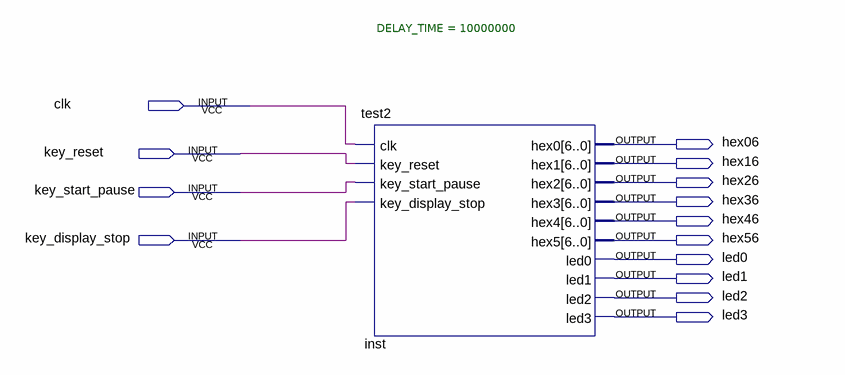
[diagram p0: schematic sheet]
// Quartus schematic Block1.bdf as structural Verilog: 1 symbols, 14 pins
module Block1 (
  input  clk,
  input  key_reset,
  input  key_start_pause,
  input  key_display_stop,
  output hex06,
  output hex16,
  output hex26,
  output hex36,
  output hex46,
  output hex56,
  output led0,
  output led1,
  output led2,
  output led3
);

  test2 #(.DELAY_TIME(10000000)) inst (
    .clk(clk), .key_reset(key_reset), .key_start_pause(key_start_pause), .key_display_stop(key_display_stop),
    .hex0(hex06), .hex1(hex16), .hex2(hex26), .hex3(hex36), .hex4(hex46), .hex5(hex56), .led0(led0),
    .led1(led1), .led2(led2), .led3(led3));
endmodule
